# Altium project 03-425A-01A.PrjPcb (part 3 of 3)

## Sheet 425AK01A_S05.SchDoc
size A3; DocumentNumber: 5; SheetNumber: 5; SheetTotal: 10; PageSetup: Record=PageOptions|CenterHorizontal=True|CenterVertical=True|PrintScale=1.01|XCorrection=1.00|YCorrection=1.00|PrintKind=1|BorderSize=5000000|LeftOffset=0|BottomOffset=0|Orientation=2|PaperLength=1000|PaperWidth=1000|Scale=100|PaperSource=15|PrintQuality=600|MediaType=1|DitherType=10|PaperKind=A3|PrintScaleMode=1; 00_Rev: D; 00_Drawn: RJG; 00_Date: 8APR2022; 00_Checked: SR; 00_Approved: GN; 00_Line2: 100MHz Reference Select Board; 00_Line3: M4 ADS; 00_Line1: Clock Buffer Circuits, RSB A
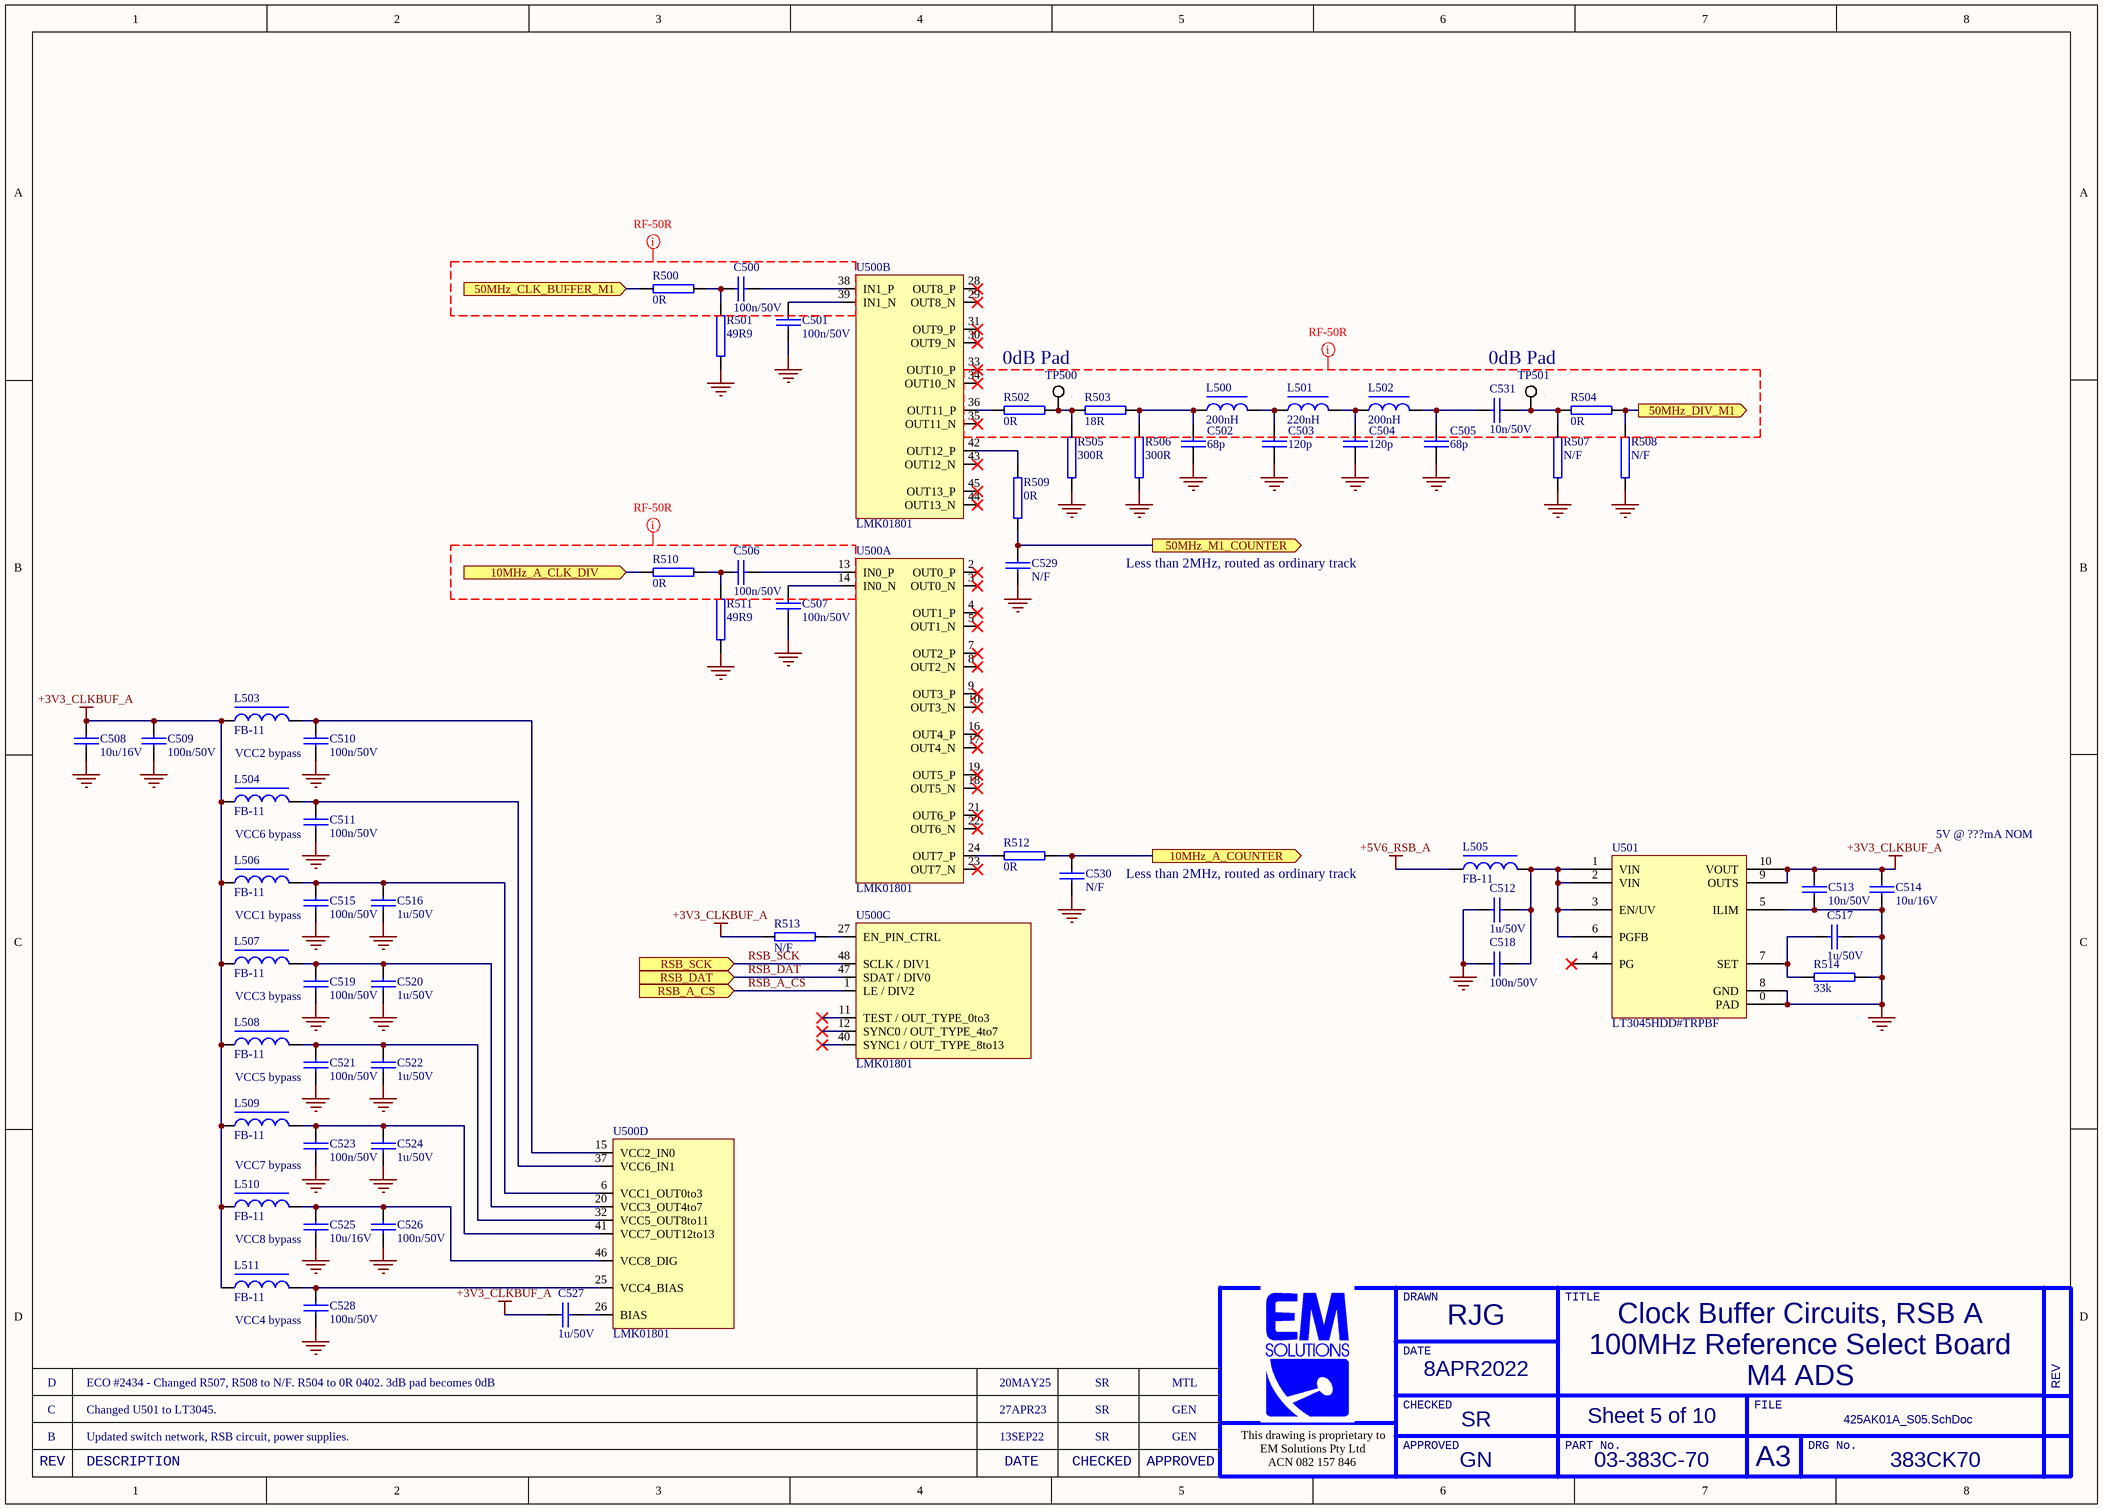
[diagram p7: 425AK01A_S05.SchDoc]

### Parts
C500  100n/50V  [0402C]
C501  100n/50V  [0402C]
C502  68p  [0402C]
C503  120p  [0402C]
C504  120p  [0402C]
C505  68p  [0402C]
C506  100n/50V  [0402C]
C507  100n/50V  [0402C]
C508  10u/16V  [0805C]
C509  100n/50V  [0402C]
C510  100n/50V  [0402C]
C511  100n/50V  [0402C]
C512  1u/50V  [0603C]
C513  10n/50V  [0402C]
C514  10u/16V  [0805C]
C515  100n/50V  [0402C]
C516  1u/50V  [0603C]
C517  1u/50V  [0603C]
C518  100n/50V  [0402C]
C519  100n/50V  [0402C]
C520  1u/50V  [0603C]
C521  100n/50V  [0402C]
C522  1u/50V  [0603C]
C523  100n/50V  [0402C]
C524  1u/50V  [0603C]
C525  10u/16V  [0805C]
C526  100n/50V  [0402C]
C527  1u/50V  [0603C]
C528  100n/50V  [0402C]
C529  N/F  [0402C]
C530  N/F  [0402C]
C531  10n/50V  [0402C]
L500  200nH  [0402L]
L501  220nH  [0402L]
L502  200nH  [0402L]
L503  FB-11  [0402L]
L504  FB-11  [0402L]
L505  FB-11  [0402L]
L506  FB-11  [0402L]
L507  FB-11  [0402L]
L508  FB-11  [0402L]
L509  FB-11  [0402L]
L510  FB-11  [0402L]
L511  FB-11  [0402L]
R500  0R  [0402]
R501  49R9  [0402]
R502  0R  [0402]
R503  18R  [0402]
R504  0R  [0402]
R505  300R  [0402]
R506  300R  [0402]
R507  N/F  [0402]
R508  N/F  [0402]
R509  0R  [0402]
R510  0R  [0402]
R511  49R9  [0402]
R512  0R  [0402]
R513  N/F  [0402]
R514  33k  [0402]
TP500  Pad  [Testpoint-0.5mm-SMT-withPaste]  (value not drawn)  (no BOM)
TP501  Pad  [Testpoint-0.5mm-SMT-withPaste]  (value not drawn)  (no BOM)
U500  LMK01801  [SQA48]  (parts A,B,C,D of 4)
U501  LT3045HDD#TRPBF  [DFN50P300X300X80_HS-11N]

### Ports
10MHz_A_CLK_DIV (in), 10MHz_A_COUNTER (out), 50MHz_CLK_BUFFER_M1 (in), 50MHz_DIV_M1 (out), 50MHz_M1_COUNTER (out), RSB_A_CS (in), RSB_DAT (in), RSB_SCK (in)

### Nets
+3V3_CLKBUF_A: C508.1 C509.1 C513.2 C514.1 C527.2 L503.1 L504.1 L506.1 L507.1 L508.1 L509.1 L510.1 L511.1 R513.1 U501.9(OUTS) U501.10(VOUT)
+5V6_RSB_A: L505.2
GND: C501.2 C502.1 C503.1 C504.1 C505.1 C507.2 C508.2 C509.2 C510.2 C511.1 C512.1 C513.1 C514.2 C515.2 C516.2 C517.2 C518.2 C519.2 C520.2 C521.2 C522.2 C523.2 C524.2 C525.2 C526.2 C528.1 C529.2 C530.2 R501.1 R505.2 R506.2 R507.2 R508.2 R511.1 R514.1 U500.0(EP) U501.0(PAD) U501.5(ILIM) U501.8(GND)
RSB_A_CS: U500.1(LE_/_DIV2) ; port RSB_A_CS
RSB_DAT: U500.47(SDAT_/_DIV0) ; port RSB_DAT
RSB_SCK: U500.48(SCLK_/_DIV1) ; port RSB_SCK
NetC500_1: C500.1 U500.38(IN1_P)
NetC500_2: C500.2 R500.1 R501.2
NetC501_1: C501.1 U500.39(IN1_N)
NetC502_2: C502.2 L500.1 R503.1 R506.1
NetC503_2: C503.2 L500.2 L501.1
NetC504_2: C504.2 L501.2 L502.1
NetC505_2: C505.2 C531.2 L502.2
NetC506_1: C506.1 U500.13(IN0_P)
NetC506_2: C506.2 R510.1 R511.2
NetC507_1: C507.1 U500.14(IN0_N)
NetC510_1: C510.1 L503.2 U500.15(VCC2_IN0)
NetC511_2: C511.2 L504.2 U500.37(VCC6_IN1)
NetC512_2: C512.2 C518.1 L505.1 U501.1(VIN) U501.2(VIN) U501.3(EN/UV) U501.6(PGFB)
NetC515_1: C515.1 C516.1 L506.2 U500.6(VCC1_OUT0to3)
NetC517_1: C517.1 R514.2 U501.7(SET)
NetC519_1: C519.1 C520.1 L507.2 U500.20(VCC3_OUT4to7)
NetC521_1: C521.1 C522.1 L508.2 U500.32(VCC5_OUT8to11)
NetC523_1: C523.1 C524.1 L509.2 U500.41(VCC7_OUT12to13)
NetC525_1: C525.1 C526.1 L510.2 U500.46(VCC8_DIG)
NetC527_1: C527.1 U500.26(BIAS)
NetC528_2: C528.2 L511.2 U500.25(VCC4_BIAS)
NetC529_1: C529.1 R509.1 ; port 50MHz_M1_COUNTER
NetC530_1: C530.1 R512.1 ; port 10MHz_A_COUNTER
NetC531_1: C531.1 R504.2 R507.1 TP501.1
NetR302_1: R500.2 ; port 50MHz_CLK_BUFFER_M1
NetR331_1: R510.2 ; port 10MHz_A_CLK_DIV
NetR502_1: R502.1 R503.2 R505.1 TP500.1
NetR502_2: R502.2 U500.36(OUT11_P)
NetR504_1: R504.1 R508.1 ; port 50MHz_DIV_M1
NetR509_2: R509.2 U500.42(OUT12_P)
NetR512_2: R512.2 U500.24(OUT7_P)
NetR513_2: R513.2 U500.27(EN_PIN_CTRL)

Not connected (* = marked no-connect by the designer): U500 2(OUT0_P)* 3(OUT0_N)* 4(OUT1_P)* 5(OUT1_N)* 7(OUT2_P)* 8(OUT2_N)* 9(OUT3_P)* 10(OUT3_N)* 11(TEST_/_OUT_TYPE_0to3)* 12(SYNC0_/_OUT_TYPE_4to7)* 16(OUT4_P)* 17(OUT4_N)* 18(OUT5_N)* 19(OUT5_P)* 21(OUT6_P)* 22(OUT6_N)* 23(OUT7_N)* 28(OUT8_P)* 29(OUT8_N)* 30(OUT9_N)* 31(OUT9_P)* 33(OUT10_P)* 34(OUT10_N)* 35(OUT11_N)* 40(SYNC1_/_OUT_TYPE_8to13)* 43(OUT12_N)* 44(OUT13_N)* 45(OUT13_P)*; U501 4(PG)*

### Layout directives
net class RF-50R: (no net found under the mark)

### Notes on the sheet
- 0dB Pad
- Less than 2MHz, routed as ordinary track
- (near C510) VCC2 bypass
- (near C511) VCC6 bypass
- 5V @ ???mA NOM
- (near C515) VCC1 bypass
- (near C519) VCC3 bypass
- (near C521) VCC5 bypass
- (near C523) VCC7 bypass
- (near C525) VCC8 bypass
- (near C528) VCC4 bypass
- D
- ECO #2434 - Changed R507, R508 to N/F. R504 to 0R 0402. 3dB pad becomes 0dB
- 20MAY25
- SR
- MTL
- B
- C
- Updated switch network, RSB circuit, power supplies.
- Changed U501 to LT3045.
- 13SEP22
- 27APR23
- GEN
- DRAWN
- TITLE
- DATE
- REV
- This drawing is proprietary to
- EM Solutions Pty Ltd
- APPROVED
- CHECKED
- PART No.
- FILE
- A3
- DRG No.
- DESCRIPTION
- ACN 082 157 846

### Library data of the parts
C500 C501 C506 C507 C509-C511 C515 C518 C519 C521 C523 C526 C528 = 41-100N-13: as C200 on sheet 425AK01A_S02; Part Number: 41-100N-13; ItemID: 41-100N-13
C502 C505 = 41-068P-08: Capacitor, 0402, 68p; Part Number: 41-068P-08
C503 C504 = 41-120P-05: Capacitor, 0402, 120p NPO; Part Number: 41-120P-05
C508 C525 = 41-010U-08: Capacitor, 0805, 10u X5R 10% 16V Ceramic, NiSn; Part Number: 41-010U-08
C512 C517 = 41-01U0-06: as C1030 on sheet 425AK01A_S10; Part Number: 41-01U0-06; ItemID: 41-01U0-06
C513 C531 = 41-010N-12: as C209 on sheet 425AK01A_S02; Part Number: 41-010N-12; ItemID: 41-010N-12
C514 = 41-010U-08: as C1010 on sheet 425AK01A_S10; Part Number: 41-010U-08; ItemID: 41-010U-08
C516 C520 C522 C524 C527 = 41-01U0-06: as C201 on sheet 425AK01A_S02; Part Number: 41-01U0-06; ItemID: 41-01U0-06
C529 C530 = 41-N/F-04: Capacitor, 0402, SOT, Not Fitted; ID: 2511; Part Number: 41-N/F-04; ItemID: 41-N/F-04
L500 L502 = 46-200N-04: Inductor, Chip, 200nH, 0402; Part Number: 46-200N-04
L501 = 46-220N-05: Inductor, Chip, 220nH, 0402; Part Number: 46-220N-05
L503 L504 L506-L511 = 46-B-11: Solid Inductor, 600ohm@100MHz, DCR=0.52, 0.3A, 0402 size; MANUFACTURER: TDK; ID: 3256; MODELNAME: MMZ1005S601C; Part Number: 46-B-11; ItemID: 46-B-11
L505 = 46-B-11: as L1006-L1008 on sheet 425AK01A_S10; Part Number: 46-B-11; ItemID: 46-B-11
R500 R502 R509 R510 R512 = 44-000R-10: as R300 on sheet 425AK01A_S03; Part Number: 44-000R-10; ItemID: 44-000R-10; MODELNAME: GENERIC
R501 R511 = 44-049R9-10: as R305 on sheet 425AK01A_S03; Part Number: 44-049R9-10; ItemID: 44-049R9-10
R503 = 44-018R-10: Resistor, 0402, 18R 1% 0.063W; MANUFACTURER: GENERIC; ID: 2594; Part Number: 44-018R-10; ItemID: 44-018R-10; MODELNAME: GENERIC
R504 = 44-000R-10: Resistor, 0402, 0R 1% 0.063W 1A; ID: 2538; MODELNAME: CRG0402ZR; Part Number: 44-000R-10; ItemID: 44-000R-10
R505 R506 = 44-300R-10: Resistor, 0402, 300R 1% 0.063W; MANUFACTURER: GENERIC; ID: 3023; Part Number: 44-300R-10; ItemID: 44-300R-10; MODELNAME: GENERIC
R507 R508 R513 = 44-N/F-10: as R204 on sheet 425AK01A_S02; Part Number: 44-N/F-10; ItemID: 44-N/F-10
R514 = 44-033K-10: Resistor, 0402, 33k 1% 0.063W; MANUFACTURER: GENERIC; ID: 2720; Part Number: 44-033K-10; ItemID: 44-033K-10; MODELNAME: GENERIC
TP500 TP501 = Pad: as TP300-TP308 on sheet 425AK01A_S03
U500 = LMK01801: Dual Clock Divider Buffer; Part Number: 53-01801-01
U501 = 52-3045-01: Volt Regulator, Vin=1.8-20V, 500mA, LDO, Low Noise, 10-DFN (3x3), -40to+150C; MANUFACTURER: ANLG DEV; ID: 3362; Part Number: 52-3045-01; MODELNAME: LT3045HDD#TRPBF; ItemID: 52-3045-01

## Sheet 425AK01A_S06.SchDoc
size A3; DocumentNumber: 6; SheetNumber: 6; SheetTotal: 10; PageSetup: Record=PageOptions|CenterHorizontal=True|CenterVertical=True|PrintScale=1.01|XCorrection=1.00|YCorrection=1.00|PrintKind=1|BorderSize=5000000|LeftOffset=0|BottomOffset=0|Orientation=2|PaperLength=1000|PaperWidth=1000|Scale=100|PaperSource=15|PrintQuality=600|MediaType=1|DitherType=10|PaperKind=A3|PrintScaleMode=1; 00_Rev: D; 00_Drawn: RJG; 00_Date: 8APR2022; 00_Checked: SR; 00_Approved: GN; 00_Line2: 100MHz Reference Select Board; 00_Line3: M4 ADS; 00_Line1: RSB B 10MHz/50MHz Input Paths
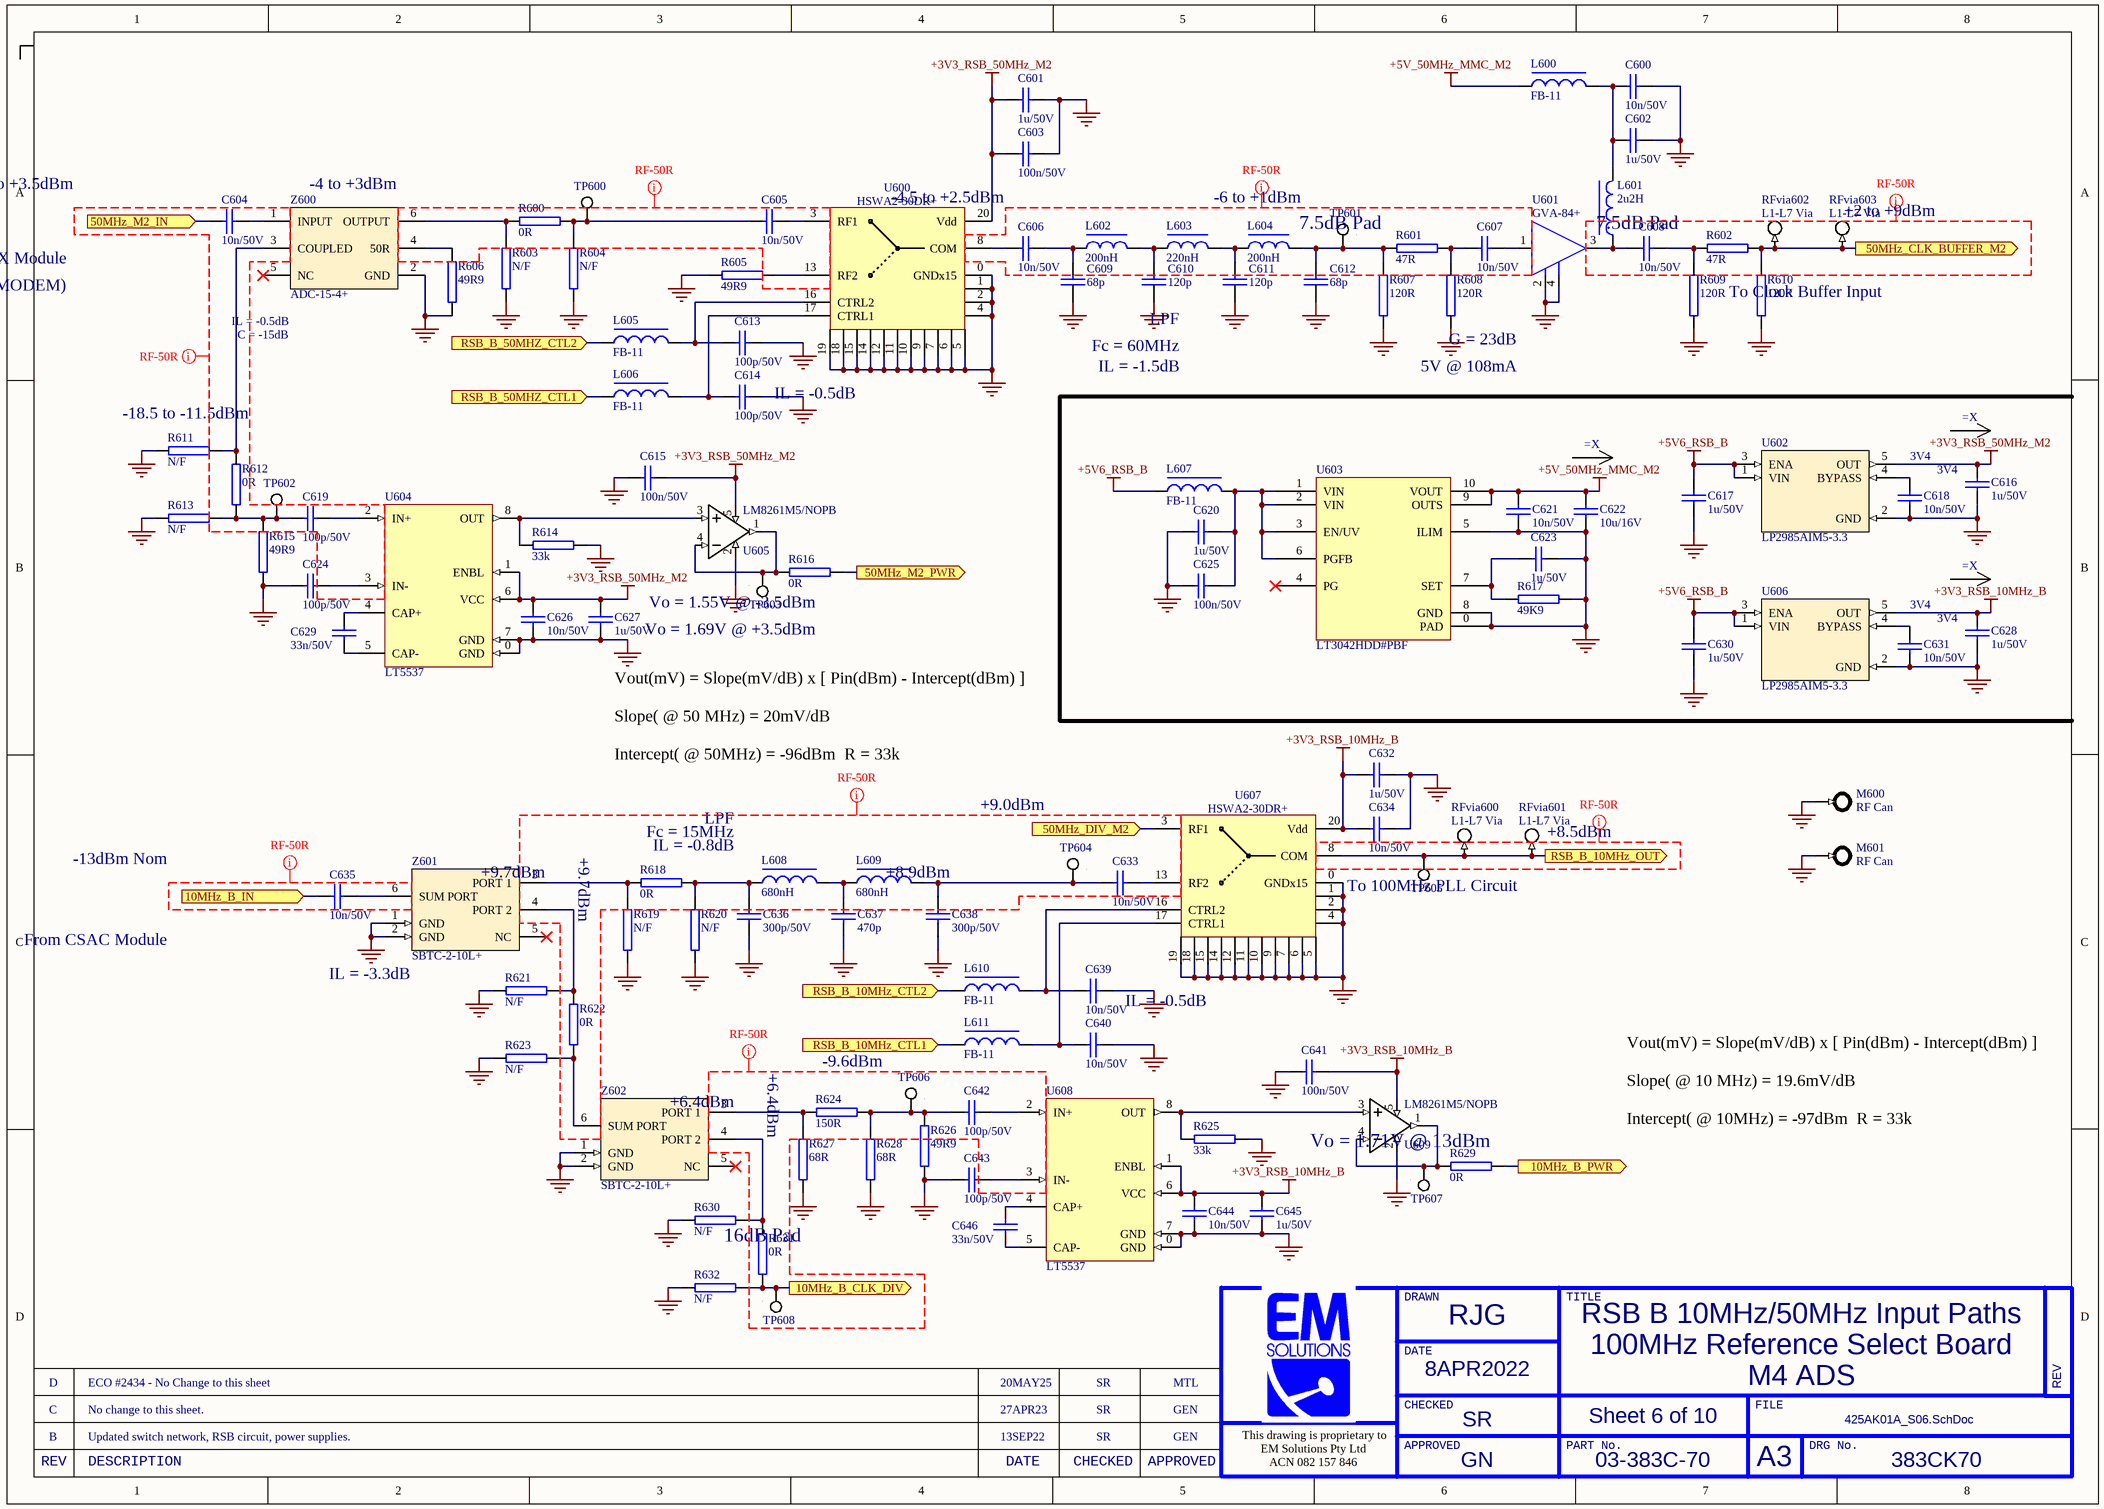
[diagram p8: 425AK01A_S06.SchDoc]

### Parts
(Parts that share a designator on the sheet are numbered #1, #2 ... from top to bottom, then left to right.)
C600  10n/50V  [0402C]
C601  1u/50V  [0603C]
C602  1u/50V  [0603C]
C603  100n/50V  [0402C]
C604  10n/50V  [0402C]
C605  10n/50V  [0402C]
C606  10n/50V  [0402C]
C607  10n/50V  [0402C]
C608  10n/50V  [0402C]
C609  68p  [0402C]
C610  120p  [0402C]
C611  120p  [0402C]
C612  68p  [0402C]
C613  100p/50V  [0402C]
C614  100p/50V  [0402C]
C615  100n/50V  [0402C]
C616  1u/50V  [0603C]
C617  1u/50V  [0603C]
C618  10n/50V  [0402C]
C619  100p/50V  [0402C]
C620  1u/50V  [0603C]
C621  10n/50V  [0402C]
C622  10u/16V  [0805C]
C623  1u/50V  [0603C]
C624  100p/50V  [0402C]
C625  100n/50V  [0402C]
C626  10n/50V  [0402C]
C627  1u/50V  [0603C]
C628  1u/50V  [0603C]
C629  33n/50V  [0402C]
C630  1u/50V  [0603C]
C631  10n/50V  [0402C]
C632  1u/50V  [0603C]
C633  10n/50V  [0402C]
C634  10n/50V  [0402C]
C635  10n/50V  [0402C]
C636  300p/50V  [0402C]
C637  470p  [0402C]
C638  300p/50V  [0402C]
C639  10n/50V  [0402C]
C640  10n/50V  [0402C]
C641  100n/50V  [0402C]
C642  100p/50V  [0402C]
C643  100p/50V  [0402C]
C644  10n/50V  [0402C]
C645  1u/50V  [0603C]
C646  33n/50V  [0402C]
GA?#4  13mA  (value not drawn)  (graphical)
GA?#5  108mA  (value not drawn)  (graphical)
GA?#6  13mA  (value not drawn)  (graphical)
L600  FB-11  [0402L]
L601  2u2H  [0805L]
L602  200nH  [0402L]
L603  220nH  [0402L]
L604  200nH  [0402L]
L605  FB-11  [0402L]
L606  FB-11  [0402L]
L607  FB-11  [0402L]
L608  680nH  [0603L]
L609  680nH  [0603L]
L610  FB-11  [0402L]
L611  FB-11  [0402L]
M600  RF Can  [Can_38x25.4x6mm]
M601  RF Can  [Can_38x25.4x6mm]
R600  0R  [0402]
R601  47R  [0402]
R602  47R  [0402]
R603  N/F  [0402]
R604  N/F  [0402]
R605  49R9  [0402]
R606  49R9  [0402]
R607  120R  [0402]
R608  120R  [0402]
R609  120R  [0402]
R610  120R  [0402]
R611  N/F  [0402]
R612  0R  [0402]
R613  N/F  [0402]
R614  33k  [0402]
R615  49R9  [0402]
R616  0R  [0402]
R617  49K9  [0402]
R618  0R  [0402]
R619  N/F  [0402]
R620  N/F  [0402]
R621  N/F  [0402]
R622  0R  [0402]
R623  N/F  [0402]
R624  150R  [0402]
R625  33k  [0402]
R626  49R9  [0402]
R627  68R  [0402]
R628  68R  [0402]
R629  0R  [0402]
R630  N/F  [0402]
R631  0R  [0402]
R632  N/F  [0402]
RFvia600  L1-L7 Via  [RFvia_L1-L7]  (no BOM)
RFvia601  L1-L7 Via  [RFvia_L1-L7]  (no BOM)
RFvia602  L1-L7 Via  [RFvia_L1-L7]  (no BOM)
RFvia603  L1-L7 Via  [RFvia_L1-L7]  (no BOM)
TP600  Pad  [Testpoint-0.5mm-SMT-withPaste]  (value not drawn)  (no BOM)
TP601  Pad  [Testpoint-0.5mm-SMT-withPaste]  (value not drawn)  (no BOM)
TP602  Pad  [Testpoint-0.5mm-SMT-withPaste]  (value not drawn)  (no BOM)
TP603  Pad  [Testpoint-0.5mm-SMT-withPaste]  (value not drawn)  (no BOM)
TP604  Pad  [Testpoint-0.5mm-SMT-withPaste]  (value not drawn)  (no BOM)
TP605  Pad  [Testpoint-0.5mm-SMT-withPaste]  (value not drawn)  (no BOM)
TP606  Pad  [Testpoint-0.5mm-SMT-withPaste]  (value not drawn)  (no BOM)
TP607  Pad  [Testpoint-0.5mm-SMT-withPaste]  (value not drawn)  (no BOM)
TP608  Pad  [Testpoint-0.5mm-SMT-withPaste]  (value not drawn)  (no BOM)
U600  HSWA2-30DR+  [DG983-1]
U601  GVA-84+  [SOT-89-RF]
U602  LP2985AIM5-3.3  [SOT-23/5]
U603  LT3042HDD#PBF  [DFN50P300X300X80_HS-11N]
U604  LT5537  [DFN-8]
U605  LM8261M5/NOPB  [SOT-23/5]
U606  LP2985AIM5-3.3  [SOT-23/5]
U607  HSWA2-30DR+  [DG983-1]
U608  LT5537  [DFN-8]
U609  LM8261M5/NOPB  [SOT-23/5]
Z600  ADC-15-4+  [ADC-15-4+]
Z601  SBTC-2-10L+  [SBTC-2-10L+]
Z602  SBTC-2-10L+  [SBTC-2-10L+]

### Ports
10MHz_B_CLK_DIV (out), 10MHz_B_IN (in), 10MHz_B_PWR (out), 50MHz_CLK_BUFFER_M2 (out), 50MHz_DIV_M2 (in), 50MHz_M2_IN (in), 50MHz_M2_PWR (out), RSB_B_10MHz_CTL1 (in), RSB_B_10MHz_CTL2 (in), RSB_B_10MHz_OUT (out), RSB_B_50MHZ_CTL1 (in), RSB_B_50MHZ_CTL2 (in)

### Nets
+3V3_RSB_10MHz_B: C628.2 C632.1 C634.1 C641.2 C644.1 C645.2 U606.5(OUT) U607.20(Vdd) U608.1(ENBL) U608.6(VCC) U609.5(V+)
+3V3_RSB_50MHz_M2: C601.1 C603.1 C615.2 C616.2 C626.1 C627.2 U600.20(Vdd) U602.5(OUT) U604.1(ENBL) U604.6(VCC) U605.5(V+)
+5V6_RSB_B: C617.2 C630.2 L607.2 U602.1(VIN) U602.3(ENA) U606.1(VIN) U606.3(ENA)
+5V_50MHz_MMC_M2: C621.2 C622.1 L600.1 U603.9(OUTS) U603.10(VOUT)
GND: C600.2 C601.2 C602.1 C603.2 C609.1 C610.1 C611.1 C612.1 C613.2 C614.2 C615.1 C616.1 C617.1 C618.1 C620.1 C621.1 C622.2 C623.2 C624.1 C625.2 C626.2 C627.1 C628.1 C630.1 C631.1 C632.2 C634.2 C636.2 C637.2 C638.2 C639.2 C640.2 C641.1 C643.1 C644.2 C645.1 M600.0 M601.0 R603.2 R604.2 R605.1 R606.1 R607.2 R608.2 R609.2 R610.2 R611.2 R613.2 R614.1 R615.1 R617.1 R619.2 R620.2 R621.2 R623.2 R625.1 R626.1 R627.2 R628.2 R630.2 R632.2 U600.0(GNDx15) U600.1(GND) U600.2(GND) U600.4(GND) U600.5(GND) U600.6(GND) U600.7(GND) U600.9(GND) U600.10(GND) U600.11(GND) U600.12(GND) U600.14(GND) U600.15(GND) U600.18(GND) U600.19(GND) U601.2 U601.4 U602.2(GND) U603.0(PAD) U603.5(ILIM) U603.8(GND) U604.0(GND) U604.7(GND) U605.2(V-) U606.2(GND) U607.0(GNDx15) U607.1(GND) U607.2(GND) U607.4(GND) U607.5(GND) U607.6(GND) U607.7(GND) U607.9(GND) U607.10(GND) U607.11(GND) U607.12(GND) U607.14(GND) U607.15(GND) U607.18(GND) U607.19(GND) U608.0(GND) U608.7(GND) U609.2(V-) Z600.2(GND) Z601.1(GND) Z601.2(GND) Z602.1(GND) Z602.2(GND)
NetC600_1: C600.1 C602.2 L600.2 L601.2
NetC604_1: C604.1 Z600.1(INPUT)
NetC604_2: C604.2 ; port 50MHz_M2_IN
NetC605_1: C605.1 R600.1 R604.1 TP600.1
NetC605_2: C605.2 U600.3(RF1)
NetC606_1: C606.1 C609.2 L602.1
NetC606_2: C606.2 U600.8(COM)
NetC607_1: C607.1 R601.1 R608.1
NetC607_2: C607.2 U601.1
NetC608_1: C608.1 L601.1 U601.3
NetC608_2: C608.2 R602.2 R609.1
NetC610_2: C610.2 L602.2 L603.1
NetC611_2: C611.2 L603.2 L604.1
NetC612_2: C612.2 L604.2 R601.2 R607.1 TP601.1
NetC613_1: C613.1 L605.1 U600.16(CTRL2)
NetC614_1: C614.1 L606.1 U600.17(CTRL1)
NetC618_2: C618.2 U602.4(BYPASS)
NetC619_1: C619.1 R612.1 R613.1 R615.2 TP602.1
NetC619_2: C619.2 U604.2(IN+)
NetC620_2: C620.2 C625.1 L607.1 U603.1(VIN) U603.2(VIN) U603.3(EN/UV) U603.6(PGFB)
NetC623_1: C623.1 R617.2 U603.7(SET)
NetC624_2: C624.2 U604.3(IN-)
NetC629_1: C629.1 U604.5(CAP-)
NetC629_2: C629.2 U604.4(CAP+)
NetC631_2: C631.2 U606.4(BYPASS)
NetC633_1: C633.1 U607.13(RF2)
NetC633_2: C633.2 C638.1 L609.2 TP604.1
NetC635_1: C635.1 ; port 10MHz_B_IN
NetC635_2: C635.2 Z601.6(SUM_PORT)
NetC636_1: C636.1 L608.1 R618.1 R620.1
NetC637_1: C637.1 L608.2 L609.1
NetC639_1: C639.1 L610.1 U607.16(CTRL2)
NetC640_1: C640.1 L611.1 U607.17(CTRL1)
NetC642_1: C642.1 R624.1 R626.2 R628.1 TP606.1
NetC642_2: C642.2 U608.2(IN+)
NetC643_2: C643.2 U608.3(IN-)
NetC646_1: C646.1 U608.5(CAP-)
NetC646_2: C646.2 U608.4(CAP+)
NetC705_1: RFvia600.1 RFvia601.1 TP605.1 U607.8(COM) ; port RSB_B_10MHz_OUT
NetL605_2: L605.2 ; port RSB_B_50MHZ_CTL2
NetL606_2: L606.2 ; port RSB_B_50MHZ_CTL1
NetL610_2: L610.2 ; port RSB_B_10MHz_CTL2
NetL611_2: L611.2 ; port RSB_B_10MHz_CTL1
NetR600_2: R600.2 R603.1 Z600.6(OUTPUT)
NetR602_1: R602.1 R610.1 RFvia602.1 RFvia603.1 ; port 50MHz_CLK_BUFFER_M2
NetR605_2: R605.2 U600.13(RF2)
NetR606_2: R606.2 Z600.4(50R)
NetR611_1: R611.1 R612.2 Z600.3(COUPLED)
NetR614_2: R614.2 U604.8(OUT) U605.3(IN+)
NetR616_1: R616.1 ; port 50MHz_M2_PWR
NetR616_2: R616.2 TP603.1 U605.1(OUT) U605.4(IN-)
NetR618_2: R618.2 R619.1 Z601.3(PORT_1)
NetR621_1: R621.1 R622.2 Z601.4(PORT_2)
NetR622_1: R622.1 R623.1 Z602.6(SUM_PORT)
NetR624_2: R624.2 R627.1 Z602.3(PORT_1)
NetR625_2: R625.2 U608.8(OUT) U609.3(IN+)
NetR629_1: R629.1 ; port 10MHz_B_PWR
NetR629_2: R629.2 TP607.1 U609.1(OUT) U609.4(IN-)
NetR630_1: R630.1 R631.2 Z602.4(PORT_2)
NetR631_1: R631.1 R632.1 TP608.1 ; port 10MHz_B_CLK_DIV
NetR804_1: U607.3(RF1) ; port 50MHz_DIV_M2

Not connected (* = marked no-connect by the designer): U603 4(PG)*; Z600 5(NC)*; Z601 5(NC)*; Z602 5(NC)*

### Layout directives
net class RF-50R: (no net found under the mark), GND

### Notes on the sheet
- (near C604) -3.5 to +3.5dBm
- -4 to +3dBm
- -4.5 to +2.5dBm
- -6 to +1dBm
- 7.5dB Pad
- +2 to +9dBm
- (near C604) From TX Module
- (GX MODEM)
- To Clock Buffer Input
- (near Z600) IL = -0.5dB
- C = -15dB
- LPF
- Fc = 60MHz
- IL = -1.5dB
- G = 23dB
- 5V @ 108mA
- -18.5 to -11.5dBm
- IL = -0.5dB
- 3V4
- (near R616) Vo = 1.55V @ -3.5dBm
- Vo = 1.69V @ +3.5dBm
- (near C627) Vout(mV) = Slope(mV/dB) x [ Pin(dBm) - Intercept(dBm) ]
  Slope( @ 50 MHz) = 20mV/dB
  Intercept( @ 50MHz) = -96dBm  R = 33k
- Fc = 15MHz
- IL = -0.8dB
- +9.0dBm
- +8.5dBm
- -13dBm Nom
- +9.7dBm
- +8.9dBm
- (near RFvia601) To 100MHz PLL Circuit
- (near C635) From CSAC Module
- (near R621) IL = -3.3dB
- +6.4dBm
- -9.6dBm
- Vout(mV) = Slope(mV/dB) x [ Pin(dBm) - Intercept(dBm) ]
  Slope( @ 10 MHz) = 19.6mV/dB
  Intercept( @ 10MHz) = -97dBm  R = 33k
- (near R629) Vo = 1.71V @ 13dBm
- 16dB Pad
- D
- ECO #2434 - No Change to this sheet
- 20MAY25
- SR
- MTL
- B
- C
- Updated switch network, RSB circuit, power supplies.
- No change to this sheet.
- 13SEP22
- 27APR23
- GEN
- DRAWN
- TITLE
- DATE
- REV
- This drawing is proprietary to
- EM Solutions Pty Ltd
- APPROVED
- CHECKED
- PART No.
- FILE
- A3
- DRG No.
- DESCRIPTION
- ACN 082 157 846

### Library data of the parts
C600 C607 C608 C626 C644 = 41-010N-12: Capacitor, 0402, 10n X7R 10% 50V Ceramic, NiSn; MANUFACTURER: MURATA; MODELNAME: GCM155R71H103KA55D; ID: 2217; Part Number: 41-010N-12; ItemID: 41-010N-12
C601 C602 C627 C632 C645 = 41-01U0-06: Capacitor, 0603, 1u X7R 10% 50V Ceramic, NiSn; MANUFACTURER: TAIYOYUDEN; ID: 2287; MODELNAME: UMK107AB7105KA; Part Number: 41-01U0-06; ItemID: 41-01U0-06
C603 C615 C625 C641 = 41-100N-13: Capacitor, 0402, 100n, X7R, 10% 50V, Ceramic; MANUFACTURER: MURATA; ID: 2441; MODELNAME: GRM155R71H104KE14J; Part Number: 41-100N-13; ItemID: 41-100N-13
C604-C606 C618 C621 C631 C633-C635 C639 C640 = 41-010N-12: Capacitor, 0402, 10n X7R 10% 50V Ceramic, NiSn; MANUFACTURER: MURATA; ID: 2217; MODELNAME: GCM155R71H103KA55D; Part Number: 41-010N-12; ItemID: 41-010N-12
C609 C612 = 41-068P-08: Capacitor, 0402, 68p; Part Number: 41-068P-08
C610 C611 = 41-120P-05: Capacitor, 0402, 120p NPO; Part Number: 41-120P-05
C613 C614 C619 C624 C642 C643 = 41-100P-11: Capacitor, 0402, 100p NPO 5% 50V Ceramic, AEC-Q200; MANUFACTURER: TDK; ID: 2448; MODELNAME: CGA2B2C0G1H101J050BA; Part Number: 41-100P-11; ItemID: 41-100P-11
C616 C617 C620 C623 C628 C630 = 41-01U0-06: Capacitor, 0603, 1u X7R 10% 50V Ceramic, NiSn; MANUFACTURER: TAIYOYUDEN; MODELNAME: UMK107AB7105KA; ID: 2287; Part Number: 41-01U0-06; ItemID: 41-01U0-06
C622 = 41-010U-08: Capacitor, 0805, 10u X7R 10% 16V Ceramic, NiSn; MANUFACTURER: SAMSUNG; ID: 2232; MODELNAME: CL21B106KOQNNNE; Part Number: 41-010U-08; ItemID: 41-010U-08
C629 C646 = 41-033N-01: *Capacitor, 0402, 33n, X7R, 10%, 50V; Part Number: 41-033N-01
C636 C638 = 41-300P-01: Capacitor, 0402, 300p NPO 5% 50V Ceramic, NiSn; MANUFACTURER: MURATA; ID: 2478; MODELNAME: GRM1555C1H301JA01D; Part Number: 41-300P-01; ItemID: 41-300P-01
C637 = 41-470P-08: Capacitor, 0402, 470p ,NPO. 5% 50V Ceramic, NiSn; MANUFACTURER: MURATA; ID: 2499; MODELNAME: GRM1555C1H471JA01D; Part Number: 41-470P-08; ItemID: 41-470P-08
GA?#4-GA?#6 = Graphical-Current-Arrow
  GA?#4 GA?#6: X: 13mA
  GA?#5: X: 108mA
L600 = 46-B-11: Solid Inductor, 600ohm@100MHz, DCR=0.52, 0.3A, 0402 size; MANUFACTURER: TDK; ID: 3256; MODELNAME: MMZ1608B301CTAH0; Part Number: 46-B-11; ItemID: 46-B-11
L601 = 46-02U2-01: Inductor, Chip, 2u2H 10%, 0805, SIMID08B Series; MANUFACTURER: SIEMENS; MODELNAME: B82498-B3222-K; Part Number: 46-02U2-01; Category: EMS Parts Master
L602 L604 = 46-200N-04: Inductor, Chip, 200nH, 0402; Part Number: 46-200N-04
L603 = 46-220N-05: Inductor, Chip, 220nH, 0402; Part Number: 46-220N-05
L605-L607 L610 L611 = 46-B-11: Solid Inductor, 600ohm@100MHz, DCR=0.52, 0.3A, 0402 size; MANUFACTURER: TDK; MODELNAME: MMZ1005S601C; ID: 3256; Part Number: 46-B-11; ItemID: 46-B-11
L608 L609 = 46-680N-02: Inductor, Chip, 680nH, 2%, 0603, 470mA, SRF=260MHz, 0603LS Series; MANUFACTURER: COILCRAFT; ID: 3246; MODELNAME: 0603LS-681XGLB; Part Number: 46-680N-02; ItemID: 46-680N-02
M600 M601 = Can-RF: Part Number: 11-0256
R600 R612 R616 R618 R622 R629 R631 = 44-000R-10: Resistor, 0402, 0R 1% 0.063W; MANUFACTURER: GENERIC; ID: 2538; Part Number: 44-000R-10; ItemID: 44-000R-10; MODELNAME: GENERIC
R601 R602 = 44-047R-10: Resistor, 0402, 47R 1% 0.063W; ID: 2786; Part Number: 44-047R-10; ItemID: 44-047R-10
R603 R604 R611 R613 R619-R621 R623 R630 R632 = 44-N/F-10: Resistor, 0402, SOT, Not Fitted; ID: 3111; Part Number: 44-N/F-10; ItemID: 44-N/F-10
R605 R606 R615 R626 = 44-049R9-10: Resistor, 0402, 49R9 1% 0.063W; ID: 2787; MODELNAME: RC0402FR-0749R9L; Part Number: 44-049R9-10; ItemID: 44-049R9-10
R607-R610 = 44-120R-10: Resistor, 0402, 120R 1% 0.063W; MANUFACTURER: GENERIC; ID: 2950; Part Number: 44-120R-10; ItemID: 44-120R-10; MODELNAME: GENERIC
R614 R625 = 44-033K-10: Resistor, 0402, 33k 1% 0.063W; MANUFACTURER: PHILIPS; ID: 2720; MODELNAME: RC32H; Part Number: 44-033K-10; ItemID: 44-033K-10
R617 = 44-49K9-01: Resistor, 0402, 49.9K, 1%, 0.1W, ThickFilm, AEC-Q200; MANUFACTURER: PANASONIC; MODELNAME: ERJ-2RKF4992X; ID: 3061; Part Number: 44-49K9-01; ItemID: 44-49K9-01
R624 = 44-150R-10: Resistor, 0402, 150R 1% 0.063W; MANUFACTURER: GENERIC; ID: 2966; Part Number: 44-150R-10; ItemID: 44-150R-10; MODELNAME: GENERIC
R627 R628 = 44-068R-10: Resistor, 0402, 68R 1% 0.063W; MANUFACTURER: GENERIC; ID: 2849; Part Number: 44-068R-10; ItemID: 44-068R-10; MODELNAME: GENERIC
RFvia600-RFvia603 = RFvia_L1-L7: RF Via from layer 1 to layer 7, on an 8-layer board.; Rule: UNIONINDEX=0|RULEKIND=PlaneClearance|NETSCOPE=AnyNet|LAYERKIND=SameLayer|NAME=Schematic Power Plane Clearance|CLEARANCE=13.7795mil|UNIT=Imperial
TP600-TP608 = Pad: Pad that can be a test point or a hot via
U600 U607 = HSWA2-30DR+: RF Switch, SPDT, DC-3GHz, Absorptive, IL=1dB, I=60dB, P=30dBm, 2V7-3V3, 4x4 QFN; MANUFACTURER: MINICCTS; ID: 3484; Part Number: 54-30-01; MODELNAME: HSWA2-30DR+; ItemID: 54-30-01
U601 = GVA-84+: MMIC, DC-7GHz, G=24dB, P1dB=20.5dBm, SOT-89; Part Number: 58-GVA84-01
U602 U606 = Regulator-Linear-3V3-LP2985: Volt Regulator, 3.3V, 150mA, LoNoise, LDO, SOT-23/5; Part Number: 52-2985-06; MPN: LP2985AIM5-3.3/NOPB; Manufacturer: Texas Instruments
U603 = 52-3042-01: Volt Regulator, Vin=1.8-20V, Vin=0-15V, 200mA, Low Noise, -40to+125C; MANUFACTURER: ANLG DEV; MODELNAME: LT3042IDD#PBF; ID: 3361; Part Number: 52-3042-01; ItemID: 52-3042-01
U604 U608 = LT5537EDDB: RF Detector, 10-1000MHz, 83dB, -40/+85C, 8-DFN 3x2mm; Part Number: 54-5537-01; MPN: LT5537EDDB
U605 U609 = OpAmp-LM8261: Opamp, RRIO, 2V5 to 30V supply, 21MHz GBWP; Part Number: 52-8621-01
Z600 = 33-0058: Directional Coupler, C=15.5dB, 5-1000MHz, SM; MANUFACTURER: MINICCTS; ID: 2077; Part Number: 33-0058; MODELNAME: ADC-15-4+; ItemID: 33-0058
Z601 Z602 = 33-0055: Divider/Combiner, 2 Way, 0 deg, 10 -1000MHz, Tx Line Tranformer; MANUFACTURER: MINICCTS; ID: 2075; Part Number: 33-0055; ItemID: 33-0055; MODELNAME: SBTC-2-10L+

## Sheet 425AK01A_S08.SchDoc
size A3; DocumentNumber: 8; SheetNumber: 8; SheetTotal: 10; PageSetup: Record=PageOptions|CenterHorizontal=True|CenterVertical=True|PrintScale=1.01|XCorrection=1.00|YCorrection=1.00|PrintKind=1|BorderSize=5000000|LeftOffset=0|BottomOffset=0|Orientation=2|PaperLength=1000|PaperWidth=1000|Scale=100|PaperSource=15|PrintQuality=600|MediaType=1|DitherType=10|PaperKind=A3|PrintScaleMode=1; 00_Rev: D; 00_Drawn: RJG; 00_Date: 8APR2022; 00_Checked: SR; 00_Approved: GN; 00_Line2: 100MHz Reference Select Board; 00_Line3: M4 ADS; 00_Line1: Clock Buffer Circuits, RSB B
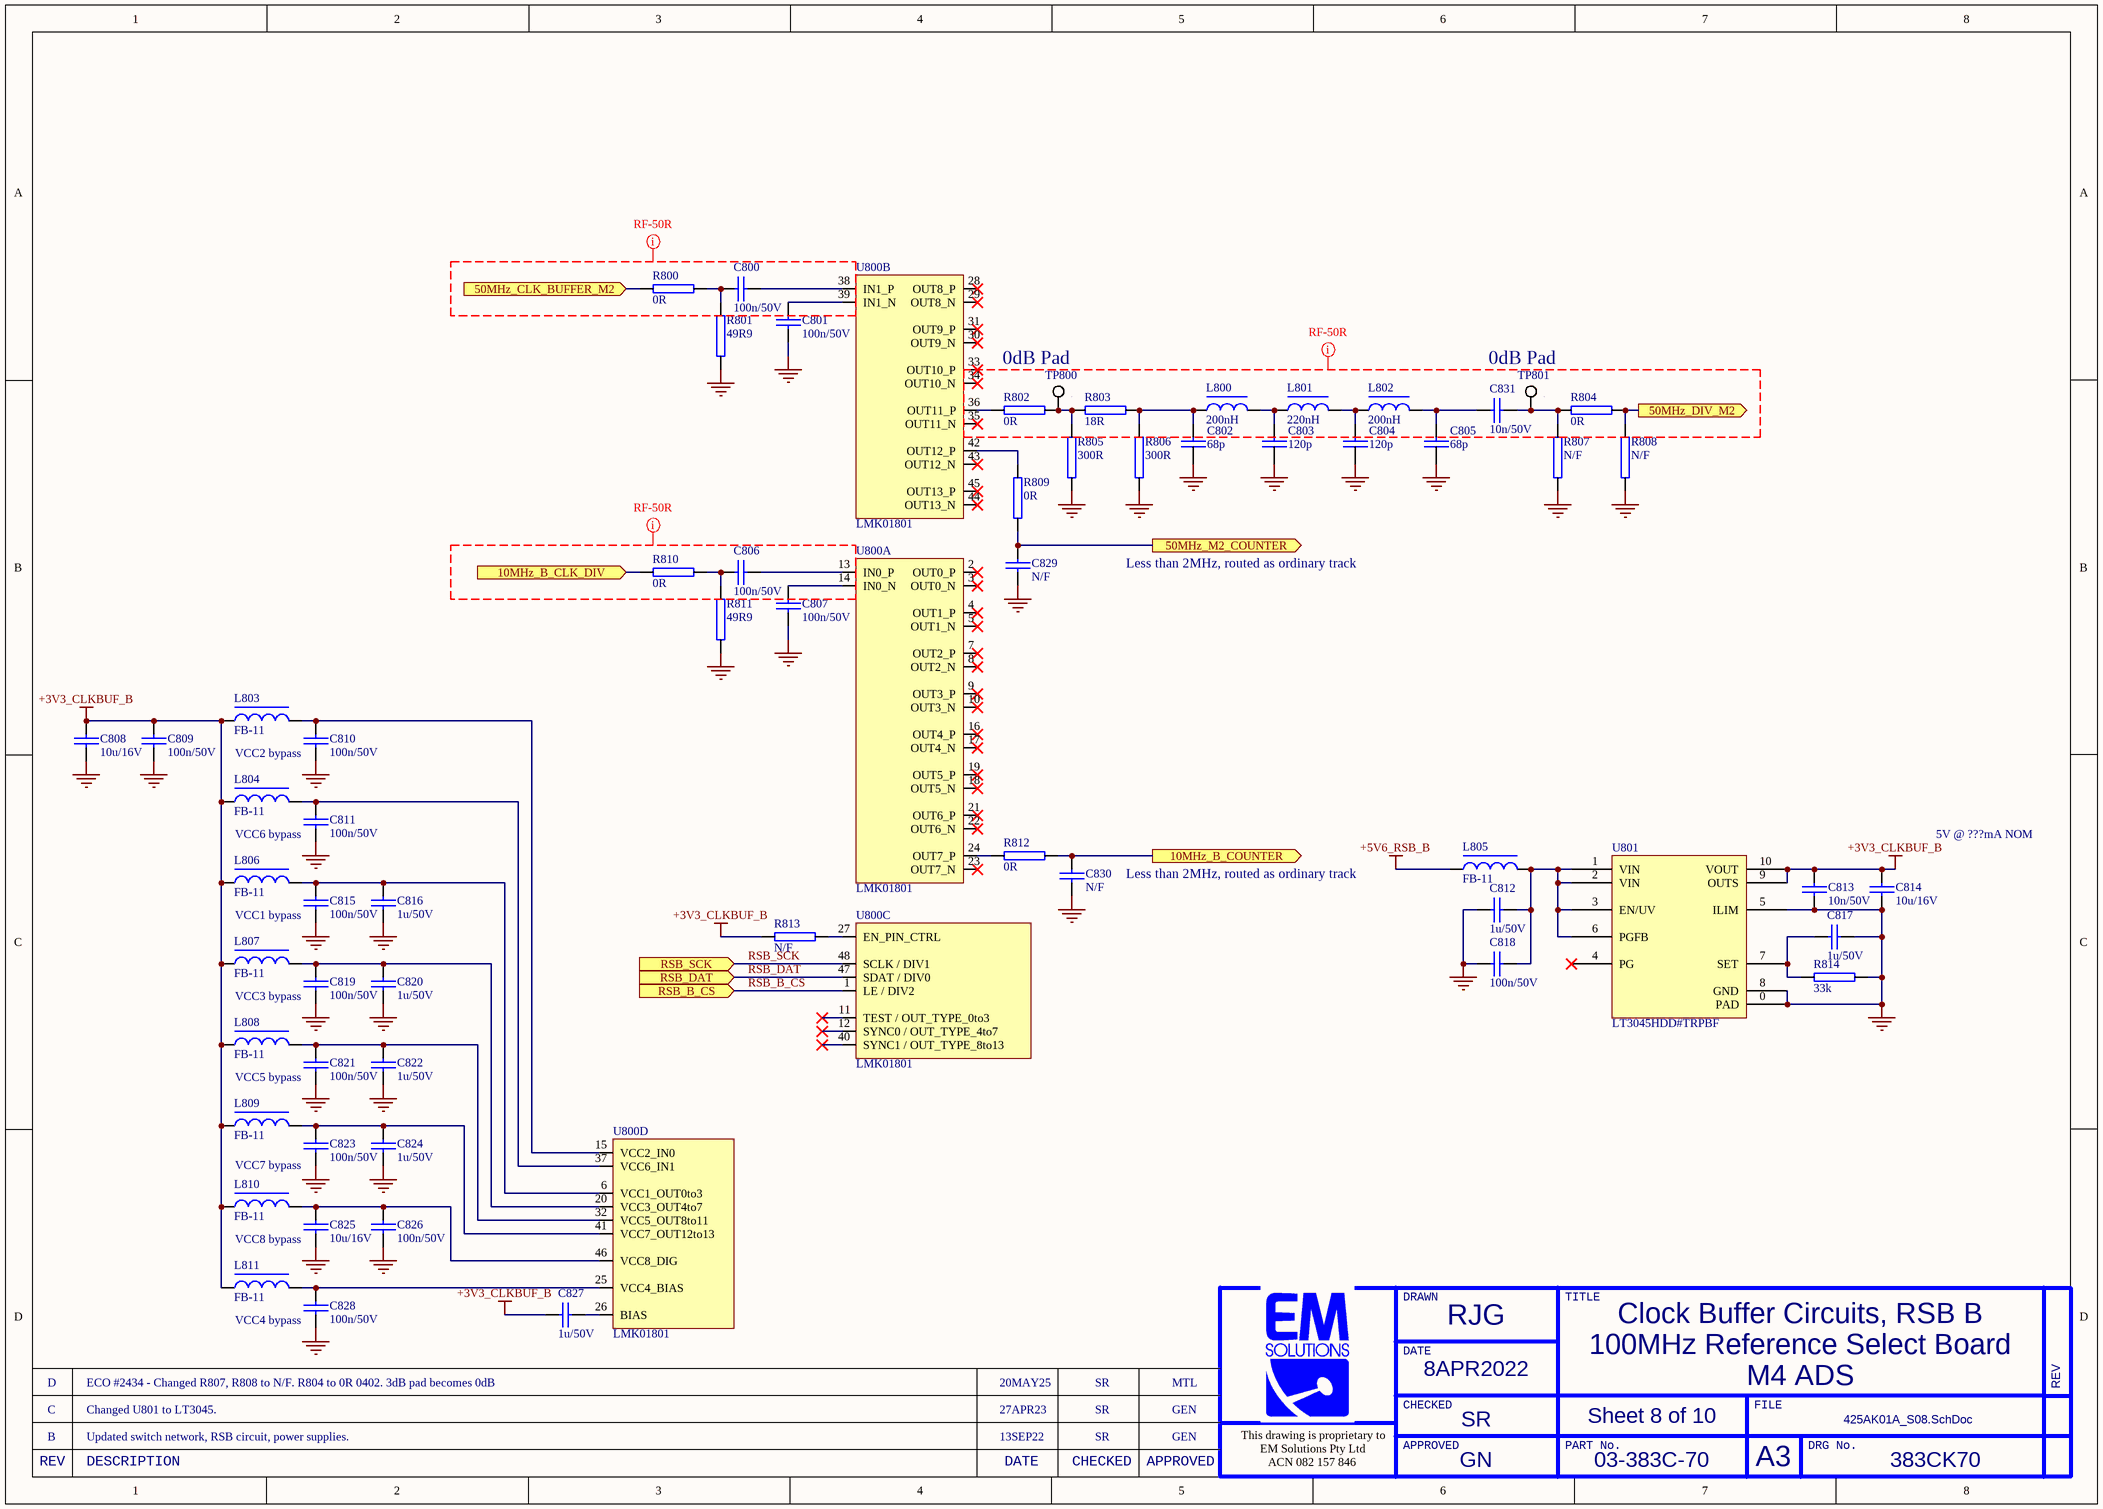
[diagram p9: 425AK01A_S08.SchDoc]

### Parts
C800  100n/50V  [0402C]
C801  100n/50V  [0402C]
C802  68p  [0402C]
C803  120p  [0402C]
C804  120p  [0402C]
C805  68p  [0402C]
C806  100n/50V  [0402C]
C807  100n/50V  [0402C]
C808  10u/16V  [0805C]
C809  100n/50V  [0402C]
C810  100n/50V  [0402C]
C811  100n/50V  [0402C]
C812  1u/50V  [0603C]
C813  10n/50V  [0402C]
C814  10u/16V  [0805C]
C815  100n/50V  [0402C]
C816  1u/50V  [0603C]
C817  1u/50V  [0603C]
C818  100n/50V  [0402C]
C819  100n/50V  [0402C]
C820  1u/50V  [0603C]
C821  100n/50V  [0402C]
C822  1u/50V  [0603C]
C823  100n/50V  [0402C]
C824  1u/50V  [0603C]
C825  10u/16V  [0805C]
C826  100n/50V  [0402C]
C827  1u/50V  [0603C]
C828  100n/50V  [0402C]
C829  N/F  [0402C]
C830  N/F  [0402C]
C831  10n/50V  [0402C]
L800  200nH  [0402L]
L801  220nH  [0402L]
L802  200nH  [0402L]
L803  FB-11  [0402L]
L804  FB-11  [0402L]
L805  FB-11  [0402L]
L806  FB-11  [0402L]
L807  FB-11  [0402L]
L808  FB-11  [0402L]
L809  FB-11  [0402L]
L810  FB-11  [0402L]
L811  FB-11  [0402L]
R800  0R  [0402]
R801  49R9  [0402]
R802  0R  [0402]
R803  18R  [0402]
R804  0R  [0402]
R805  300R  [0402]
R806  300R  [0402]
R807  N/F  [0402]
R808  N/F  [0402]
R809  0R  [0402]
R810  0R  [0402]
R811  49R9  [0402]
R812  0R  [0402]
R813  N/F  [0402]
R814  33k  [0402]
TP800  Pad  [Testpoint-0.5mm-SMT-withPaste]  (value not drawn)  (no BOM)
TP801  Pad  [Testpoint-0.5mm-SMT-withPaste]  (value not drawn)  (no BOM)
U800  LMK01801  [SQA48]  (parts A,B,C,D of 4)
U801  LT3045HDD#TRPBF  [DFN50P300X300X80_HS-11N]

### Ports
10MHz_B_CLK_DIV (in), 10MHz_B_COUNTER (out), 50MHz_CLK_BUFFER_M2 (in), 50MHz_DIV_M2 (out), 50MHz_M2_COUNTER (out), RSB_B_CS (in), RSB_DAT (in), RSB_SCK (in)

### Nets
+3V3_CLKBUF_B: C808.1 C809.1 C813.2 C814.1 C827.2 L803.1 L804.1 L806.1 L807.1 L808.1 L809.1 L810.1 L811.1 R813.1 U801.9(OUTS) U801.10(VOUT)
+5V6_RSB_B: L805.2
GND: C801.2 C802.1 C803.1 C804.1 C805.1 C807.2 C808.2 C809.2 C810.2 C811.1 C812.1 C813.1 C814.2 C815.2 C816.2 C817.2 C818.2 C819.2 C820.2 C821.2 C822.2 C823.2 C824.2 C825.2 C826.2 C828.1 C829.2 C830.2 R801.1 R805.2 R806.2 R807.2 R808.2 R811.1 R814.1 U800.0(EP) U801.0(PAD) U801.5(ILIM) U801.8(GND)
RSB_B_CS: U800.1(LE_/_DIV2) ; port RSB_B_CS
RSB_DAT: U800.47(SDAT_/_DIV0) ; port RSB_DAT
RSB_SCK: U800.48(SCLK_/_DIV1) ; port RSB_SCK
NetC800_1: C800.1 U800.38(IN1_P)
NetC800_2: C800.2 R800.1 R801.2
NetC801_1: C801.1 U800.39(IN1_N)
NetC802_2: C802.2 L800.1 R803.1 R806.1
NetC803_2: C803.2 L800.2 L801.1
NetC804_2: C804.2 L801.2 L802.1
NetC805_2: C805.2 C831.2 L802.2
NetC806_1: C806.1 U800.13(IN0_P)
NetC806_2: C806.2 R810.1 R811.2
NetC807_1: C807.1 U800.14(IN0_N)
NetC810_1: C810.1 L803.2 U800.15(VCC2_IN0)
NetC811_2: C811.2 L804.2 U800.37(VCC6_IN1)
NetC812_2: C812.2 C818.1 L805.1 U801.1(VIN) U801.2(VIN) U801.3(EN/UV) U801.6(PGFB)
NetC815_1: C815.1 C816.1 L806.2 U800.6(VCC1_OUT0to3)
NetC817_1: C817.1 R814.2 U801.7(SET)
NetC819_1: C819.1 C820.1 L807.2 U800.20(VCC3_OUT4to7)
NetC821_1: C821.1 C822.1 L808.2 U800.32(VCC5_OUT8to11)
NetC823_1: C823.1 C824.1 L809.2 U800.41(VCC7_OUT12to13)
NetC825_1: C825.1 C826.1 L810.2 U800.46(VCC8_DIG)
NetC827_1: C827.1 U800.26(BIAS)
NetC828_2: C828.2 L811.2 U800.25(VCC4_BIAS)
NetC829_1: C829.1 R809.1 ; port 50MHz_M2_COUNTER
NetC830_1: C830.1 R812.1 ; port 10MHz_B_COUNTER
NetC831_1: C831.1 R804.2 R807.1 TP801.1
NetR602_1: R800.2 ; port 50MHz_CLK_BUFFER_M2
NetR631_1: R810.2 ; port 10MHz_B_CLK_DIV
NetR802_1: R802.1 R803.2 R805.1 TP800.1
NetR802_2: R802.2 U800.36(OUT11_P)
NetR804_1: R804.1 R808.1 ; port 50MHz_DIV_M2
NetR809_2: R809.2 U800.42(OUT12_P)
NetR812_2: R812.2 U800.24(OUT7_P)
NetR813_2: R813.2 U800.27(EN_PIN_CTRL)

Not connected (* = marked no-connect by the designer): U800 2(OUT0_P)* 3(OUT0_N)* 4(OUT1_P)* 5(OUT1_N)* 7(OUT2_P)* 8(OUT2_N)* 9(OUT3_P)* 10(OUT3_N)* 11(TEST_/_OUT_TYPE_0to3)* 12(SYNC0_/_OUT_TYPE_4to7)* 16(OUT4_P)* 17(OUT4_N)* 18(OUT5_N)* 19(OUT5_P)* 21(OUT6_P)* 22(OUT6_N)* 23(OUT7_N)* 28(OUT8_P)* 29(OUT8_N)* 30(OUT9_N)* 31(OUT9_P)* 33(OUT10_P)* 34(OUT10_N)* 35(OUT11_N)* 40(SYNC1_/_OUT_TYPE_8to13)* 43(OUT12_N)* 44(OUT13_N)* 45(OUT13_P)*; U801 4(PG)*

### Layout directives
net class RF-50R: (no net found under the mark)

### Notes on the sheet
- 0dB Pad
- Less than 2MHz, routed as ordinary track
- (near C810) VCC2 bypass
- (near C811) VCC6 bypass
- 5V @ ???mA NOM
- (near C815) VCC1 bypass
- (near C819) VCC3 bypass
- (near C821) VCC5 bypass
- (near C823) VCC7 bypass
- (near C825) VCC8 bypass
- (near C828) VCC4 bypass
- D
- ECO #2434 - Changed R807, R808 to N/F. R804 to 0R 0402. 3dB pad becomes 0dB
- 20MAY25
- SR
- MTL
- B
- C
- Updated switch network, RSB circuit, power supplies.
- Changed U801 to LT3045.
- 13SEP22
- 27APR23
- GEN
- DRAWN
- TITLE
- DATE
- REV
- This drawing is proprietary to
- EM Solutions Pty Ltd
- APPROVED
- CHECKED
- PART No.
- FILE
- A3
- DRG No.
- DESCRIPTION
- ACN 082 157 846

### Library data of the parts
C800 C801 C806 C807 C809-C811 C815 C818 C819 C821 C823 C826 C828 = 41-100N-13: as C603 on sheet 425AK01A_S06; Part Number: 41-100N-13; ItemID: 41-100N-13
C802 C805 = 41-068P-08: Capacitor, 0402, 68p; Part Number: 41-068P-08
C803 C804 = 41-120P-05: Capacitor, 0402, 120p NPO; Part Number: 41-120P-05
C808 C825 = 41-010U-08: Capacitor, 0805, 10u X5R 10% 16V Ceramic, NiSn; Part Number: 41-010U-08
C812 C817 = 41-01U0-06: as C616 on sheet 425AK01A_S06; Part Number: 41-01U0-06; ItemID: 41-01U0-06
C813 C831 = 41-010N-12: as C604-C606 on sheet 425AK01A_S06; Part Number: 41-010N-12; ItemID: 41-010N-12
C814 = 41-010U-08: as C622 on sheet 425AK01A_S06; Part Number: 41-010U-08; ItemID: 41-010U-08
C816 C820 C822 C824 C827 = 41-01U0-06: as C601 on sheet 425AK01A_S06; Part Number: 41-01U0-06; ItemID: 41-01U0-06
C829 C830 = 41-N/F-04: Capacitor, 0402, SOT, Not Fitted; ID: 2511; Part Number: 41-N/F-04; ItemID: 41-N/F-04
L800 L802 = 46-200N-04: Inductor, Chip, 200nH, 0402; Part Number: 46-200N-04
L801 = 46-220N-05: Inductor, Chip, 220nH, 0402; Part Number: 46-220N-05
L803 L804 L806-L811 = 46-B-11: Solid Inductor, 600ohm@100MHz, DCR=0.52, 0.3A, 0402 size; MANUFACTURER: TDK; ID: 3256; MODELNAME: MMZ1005S601C; Part Number: 46-B-11; ItemID: 46-B-11
L805 = 46-B-11: as L605-L607 on sheet 425AK01A_S06; Part Number: 46-B-11; ItemID: 46-B-11
R800 R802 R809 R810 R812 = 44-000R-10: as R600 on sheet 425AK01A_S06; Part Number: 44-000R-10; ItemID: 44-000R-10; MODELNAME: GENERIC
R801 R811 = 44-049R9-10: as R605 on sheet 425AK01A_S06; Part Number: 44-049R9-10; ItemID: 44-049R9-10
R803 = 44-018R-10: Resistor, 0402, 18R 1% 0.063W; MANUFACTURER: GENERIC; ID: 2594; Part Number: 44-018R-10; ItemID: 44-018R-10; MODELNAME: GENERIC
R804 = 44-000R-10: Resistor, 0402, 0R 1% 0.063W 1A; ID: 2538; MODELNAME: CRG0402ZR; Part Number: 44-000R-10; ItemID: 44-000R-10
R805 R806 = 44-300R-10: Resistor, 0402, 300R 1% 0.063W; MANUFACTURER: GENERIC; ID: 3023; Part Number: 44-300R-10; ItemID: 44-300R-10; MODELNAME: GENERIC
R807 R808 R813 = 44-N/F-10: as R603 on sheet 425AK01A_S06; Part Number: 44-N/F-10; ItemID: 44-N/F-10
R814 = 44-033K-10: Resistor, 0402, 33k 1% 0.063W; MANUFACTURER: GENERIC; ID: 2720; Part Number: 44-033K-10; ItemID: 44-033K-10; MODELNAME: GENERIC
TP800 TP801 = Pad: as TP600-TP608 on sheet 425AK01A_S06
U800 = LMK01801: Dual Clock Divider Buffer; Part Number: 53-01801-01
U801 = 52-3045-01: Volt Regulator, Vin=1.8-20V, 500mA, LDO, Low Noise, 10-DFN (3x3), -40to+150C; MANUFACTURER: ANLG DEV; ID: 3362; Part Number: 52-3045-01; MODELNAME: LT3045HDD#TRPBF; ItemID: 52-3045-01

## Nets that join several sheets
+3V3_SW_A: 425AK01A_S09 (7 pins), 425AK01A_S10 (C1033.2 U1003.5)
+3V3_SW_B: 425AK01A_S09 (7 pins), 425AK01A_S10 (C1048.2 U1006.5)
+5V6_PLL_A: 425AK01A_S04 (L406.2 L407.2), 425AK01A_S10 (7 pins)
+5V6_PLL_B: 425AK01A_S07 (L706.2 L707.2), 425AK01A_S10 (7 pins)
+5V6_RSB_A: 425AK01A_S10 (PADS1011.1 R1020.1), 425AK01A_S03 (7 pins), 425AK01A_S05 (L505.2)
+5V6_RSB_B: 425AK01A_S10 (PADS1012.1 R1021.1), 425AK01A_S06 (7 pins), 425AK01A_S08 (L805.2)
+5V_FB_A: 425AK01A_S09 (L901.1), 425AK01A_S10 (C1031.2 C1032.1 U1002.9 U1002.10)
+5V_FB_B: 425AK01A_S09 (L908.1), 425AK01A_S10 (C1046.2 C1047.1 U1005.9 U1005.10)
+24V: 425AK01A_S01 (C100.1 C101.1 C102.1 L100.2), 425AK01A_S10 (8 pins)
DVDD_3V3: 425AK01A_S02 (44 pins), 425AK01A_S10 (L1007.2 PADS1015.1)
GND: 425AK01A_S01 (38 pins), 425AK01A_S04 (48 pins), 425AK01A_S07 (48 pins), 425AK01A_S09 (95 pins), 425AK01A_S02 (51 pins), 425AK01A_S10 (97 pins), 425AK01A_S03 (109 pins), 425AK01A_S05 (39 pins), 425AK01A_S06 (109 pins), 425AK01A_S08 (39 pins)
LOCK_VCXO_A: 425AK01A_S04 (U401.14), 425AK01A_S02 (U200.45)
LOCK_VCXO_B: 425AK01A_S07 (U701.14), 425AK01A_S02 (U200.44)
NetC304_2: 425AK01A_S01 (J100.1), 425AK01A_S03 (C304.2)
NetC335_1: 425AK01A_S01 (J101.1 RFvia100.1 RFvia101.1), 425AK01A_S03 (C335.1)
NetC405_1: 425AK01A_S04 (C405.1 TP400.1), 425AK01A_S03 (RFvia302.1 RFvia303.1 TP305.1 U307.8)
NetC529_1: 425AK01A_S02 (U200.63), 425AK01A_S05 (C529.1 R509.1)
NetC530_1: 425AK01A_S02 (U200.67), 425AK01A_S05 (C530.1 R512.1)
NetC604_2: 425AK01A_S01 (J102.1), 425AK01A_S06 (C604.2)
NetC635_1: 425AK01A_S01 (5 pins), 425AK01A_S06 (C635.1)
NetC705_1: 425AK01A_S07 (C705.1 TP700.1), 425AK01A_S06 (RFvia600.1 RFvia601.1 TP605.1 U607.8)
NetC829_1: 425AK01A_S02 (U200.54), 425AK01A_S08 (C829.1 R809.1)
NetC830_1: 425AK01A_S02 (U200.59), 425AK01A_S08 (C830.1 R812.1)
NetC904_1: 425AK01A_S04 (R401.2 RFvia402.1 RFvia403.1), 425AK01A_S09 (C904.1)
NetC908_2: 425AK01A_S01 (J105.1), 425AK01A_S09 (C908.2)
NetC927_2: 425AK01A_S01 (J106.1), 425AK01A_S09 (C927.2)
NetC928_1: 425AK01A_S07 (R701.2 RFvia702.1 RFvia703.1), 425AK01A_S09 (C928.1)
NetL305_2: 425AK01A_S02 (U200.62), 425AK01A_S03 (L305.2)
NetL306_2: 425AK01A_S02 (U200.60), 425AK01A_S03 (L306.2)
NetL310_2: 425AK01A_S02 (U200.58), 425AK01A_S03 (L310.2)
NetL311_2: 425AK01A_S02 (U200.55), 425AK01A_S03 (L311.2)
NetL605_2: 425AK01A_S02 (U200.84), 425AK01A_S06 (L605.2)
NetL606_2: 425AK01A_S02 (U200.83), 425AK01A_S06 (L606.2)
NetL610_2: 425AK01A_S02 (U200.82), 425AK01A_S06 (L610.2)
NetL611_2: 425AK01A_S02 (U200.81), 425AK01A_S06 (L611.2)
NetL905_1: 425AK01A_S09 (L905.1 TP903.1), 425AK01A_S02 (U200.86)
NetL906_1: 425AK01A_S09 (L906.1 TP904.1), 425AK01A_S02 (U200.85)
NetL912_1: 425AK01A_S09 (L912.1 TP909.1), 425AK01A_S02 (U200.88)
NetL913_1: 425AK01A_S09 (L913.1 TP910.1), 425AK01A_S02 (U200.87)
NetR302_1: 425AK01A_S03 (R302.1 R310.1 RFvia300.1 RFvia301.1), 425AK01A_S05 (R500.2)
NetR316_1: 425AK01A_S02 (U200.30), 425AK01A_S03 (R316.1)
NetR329_1: 425AK01A_S02 (U200.29), 425AK01A_S03 (R329.1)
NetR331_1: 425AK01A_S03 (R331.1 R332.1 TP308.1), 425AK01A_S05 (R510.2)
NetR504_1: 425AK01A_S03 (U307.3), 425AK01A_S05 (R504.1 R508.1)
NetR602_1: 425AK01A_S06 (R602.1 R610.1 RFvia602.1 RFvia603.1), 425AK01A_S08 (R800.2)
NetR616_1: 425AK01A_S02 (U200.34), 425AK01A_S06 (R616.1)
NetR629_1: 425AK01A_S02 (U200.33), 425AK01A_S06 (R629.1)
NetR631_1: 425AK01A_S06 (R631.1 R632.1 TP608.1), 425AK01A_S08 (R810.2)
NetR804_1: 425AK01A_S06 (U607.3), 425AK01A_S08 (R804.1 R808.1)
REF_DETECT_A: 425AK01A_S04 (Q400.C), 425AK01A_S02 (R202.1 U200.46)
REF_DETECT_B: 425AK01A_S07 (Q700.C), 425AK01A_S02 (R203.1 U200.39)
REF_OUT_LEVEL_1: 425AK01A_S09 (R914.2), 425AK01A_S02 (U200.36)
REF_OUT_LEVEL_2: 425AK01A_S09 (R929.2), 425AK01A_S02 (U200.35)
RS485_N: 425AK01A_S01 (J104.9 R100.1), 425AK01A_S02 (U202.17)
RS485_P: 425AK01A_S01 (J104.4 R100.2), 425AK01A_S02 (U202.19)
RSB_A_CS: 425AK01A_S02 (U200.65), 425AK01A_S05 (U500.1)
RSB_A_ON: 425AK01A_S02 (R201.1 U200.32), 425AK01A_S10 (U1000.14 U1000.27)
RSB_B_CS: 425AK01A_S02 (U200.56), 425AK01A_S08 (U800.1)
RSB_B_ON: 425AK01A_S02 (R200.1 U200.31), 425AK01A_S10 (U1001.14 U1001.27)
RSB_DAT: 425AK01A_S02 (U200.61), 425AK01A_S05 (U500.47), 425AK01A_S08 (U800.47)
RSB_SCK: 425AK01A_S02 (U200.57), 425AK01A_S05 (U500.48), 425AK01A_S08 (U800.48)
SPI_CLK: 425AK01A_S04 (U401.11), 425AK01A_S07 (U701.11), 425AK01A_S02 (U200.42)
SPI_DAT: 425AK01A_S04 (U401.12), 425AK01A_S07 (U701.12), 425AK01A_S02 (U200.41)
SPI_LE_VCXO_A: 425AK01A_S04 (U401.13), 425AK01A_S02 (U200.43)
SPI_LE_VCXO_B: 425AK01A_S07 (U701.13), 425AK01A_S02 (U200.40)